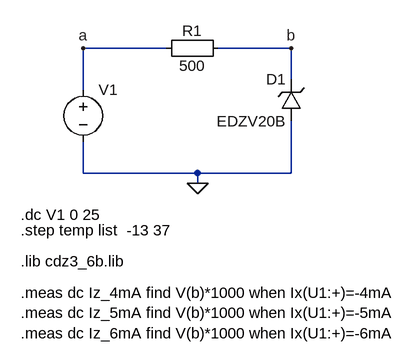
[diagram p0: schematic VA-R4.asc]
VA-R4.asc, the LTspice schematic file:
Version 4
SHEET 1 880 680
WIRE 96 -288 -32 -288
WIRE 288 -288 176 -288
WIRE 288 -240 288 -288
WIRE -32 -224 -32 -288
WIRE -32 -96 -32 -144
WIRE 144 -96 -32 -96
WIRE 288 -96 288 -176
WIRE 288 -96 144 -96
WIRE 144 -80 144 -96
FLAG 144 -80 0
FLAG 288 -288 b
FLAG -32 -288 a
SYMBOL Misc\\EuropeanResistor 192 -304 R90
WINDOW 0 5 56 VBottom 2
WINDOW 3 27 56 VTop 2
SYMATTR InstName R1
SYMATTR Value 500
SYMBOL voltage -32 -240 R0
WINDOW 3 24 96 Invisible 2
SYMATTR Value ""
SYMATTR InstName V1
SYMBOL zener 304 -176 R180
WINDOW 0 24 64 Left 2
WINDOW 3 24 0 Left 2
SYMATTR InstName D1
SYMATTR Value EDZV20B
TEXT -128 -32 Left 2 !.dc V1 0 25
TEXT -128 -8 Left 2 !.step temp list  -13 37
TEXT -128 40 Left 2 !.lib cdz3_6b.lib
TEXT -128 88 Left 2 !.meas dc Iz_4mA find V(b)*1000 when Ix(U1:+)=-4mA\n.meas dc Iz_5mA find V(b)*1000 when Ix(U1:+)=-5mA\n.meas dc Iz_6mA find V(b)*1000 when Ix(U1:+)=-6mA

The netlist it stands for:
* VA-R4.asc
R1 b a 500
V1 a 0
D1 0 b EDZV20B
.model D D
.lib standard.dio
.dc V1 0 25
.step temp list  -13 37
.lib cdz3_6b.lib
.meas dc Iz_4mA find V(b)*1000 when Ix(U1:+)=-4mA
.meas dc Iz_5mA find V(b)*1000 when Ix(U1:+)=-5mA
.meas dc Iz_6mA find V(b)*1000 when Ix(U1:+)=-6mA
.backanno
.end